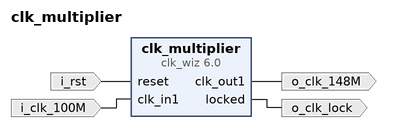
[diagram p0: block diagram of the top level]
# Vivado block design clk_multiplier, xc7a35ticsg324-1L, Vivado 2020.2
create_bd_design clk_multiplier

create_bd_port -dir I -type rst i_rst
set_property -dict {CONFIG.POLARITY ACTIVE_HIGH} [get_bd_ports i_rst]
create_bd_port -dir I -type clk i_clk_100M
set_property -dict {CONFIG.FREQ_HZ 100000000} [get_bd_ports i_clk_100M]
create_bd_port -dir O -type clk o_clk_148M
create_bd_port -dir O o_clk_lock

create_bd_cell -type ip -vlnv xilinx.com:ip:clk_wiz:6.0 clk_multiplier
set_property -dict [list \
  CONFIG.CLKOUT1_JITTER 217.614 \
  CONFIG.CLKOUT1_PHASE_ERROR 245.344 \
  CONFIG.CLKOUT1_REQUESTED_OUT_FREQ 148.5 \
  CONFIG.MMCM_CLKFBOUT_MULT_F 37.125 \
  CONFIG.MMCM_CLKOUT0_DIVIDE_F 6.250 \
  CONFIG.MMCM_DIVCLK_DIVIDE 4 \
] [get_bd_cells clk_multiplier]

# ---- connections ----

connect_bd_net [get_bd_ports i_rst] [get_bd_pins clk_multiplier/reset]
connect_bd_net [get_bd_ports i_clk_100M] [get_bd_pins clk_multiplier/clk_in1]
connect_bd_net [get_bd_pins clk_multiplier/clk_out1] [get_bd_ports o_clk_148M]
connect_bd_net [get_bd_pins clk_multiplier/locked] [get_bd_ports o_clk_lock]

validate_bd_design
save_bd_design
